# EAGLE design HM_Core (EAGLE 9.2.2)
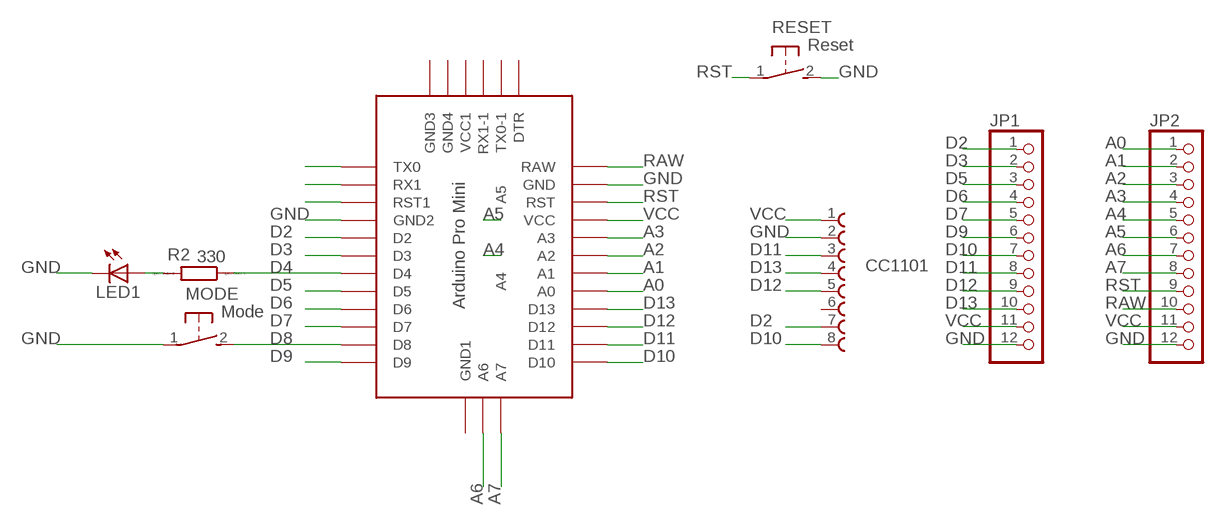
[diagram p0: schematic, sheet 1]

## Parts
CC1101  62000811121  [62000811121]
JP1  PINHD-1X12  [1X12]
JP2  PINHD-1X12  [1X12]
LED1  LED3MM  [LED3MM]
MODE  Mode  31-XX  [B3F-31XX]
R2  330  R0207/10  [0207/10]
RESET  Reset  31-XX  [B3F-31XX]
U$1  ABK-PRO-MINI  [ABK-PRO-MINI]

## Nets
A0: JP2.1 U$1.A0
A1: JP2.2 U$1.A1
A2: JP2.3 U$1.A2
A3: JP2.4 U$1.A3
A4: JP2.5 U$1.A4
A5: JP2.6 U$1.A5
A6: JP2.7 U$1.A6
A7: JP2.8 U$1.A7
D2: CC1101.7 JP1.1 U$1.D2
D3: JP1.2 U$1.D3
D4: R2.1 U$1.D4
D5: JP1.3 U$1.D5
D6: JP1.4 U$1.D6
D7: JP1.5 U$1.D7
D8: MODE.2(S) U$1.D8
D9: JP1.6 U$1.D9
D10: CC1101.8 JP1.7 U$1.D10
D11: CC1101.3 JP1.8 U$1.D11
D12: CC1101.5 JP1.9 U$1.D12
D13: CC1101.4 JP1.10 U$1.D13
GND: CC1101.2 JP1.12 JP2.12 LED1.K(C) MODE.1(P) RESET.2(S) U$1.GND U$1.GND1(GND2)
N$2: LED1.A R2.2
N$42: U$1.TX0
N$43: U$1.RX1
N$44: U$1.RST1
RAW: JP2.10 U$1.RAW
RST: JP2.9 RESET.1(P) U$1.RST
VCC: CC1101.1 JP1.11 JP2.11 U$1.VCC
Unconnected: CC1101.6 U$1.DTR U$1.GND2(GND3) U$1.GND3(GND4) U$1.GND4(GND1) U$1.RX1-1 U$1.TX0-1 U$1.VCC1

## Library data of the parts
CC1101 = Wurth_Elektronik_Electromechanic_Board_to_Board_Connectors_rev18b:62000811121: WR-PHD 2.00mm Pin Header, 8 Pins=>Code : Con_BTB_PHD_2.00_1_THT_62000811121 <http://katalog.we-online.de/media/images/eican/Con_BTB_PHD_2.00_1_THT_6200xx11121_pf2.jpg> Details see: http://katalog.we-online.de/en/em/620_0xx_111_21 Created 2014-06-03, Karrer Zheng 2014 (C) Würth Elektronik
JP1 JP2 = adafruit:PINHD-1X12: PIN HEADER
LED1 = led:LED: LED OSRAM: - CHIPLED LG R971, LG N971, LY N971, LG Q971, LY Q971, LO R971, LY R971 LH N974, LH R974 LS Q976, LO Q976, LY Q976 LO Q996 - Hyper CHIPLED LW Q18S LB Q993, LB Q99A, LB R99A - SideLED LS A670, LO A670, LY A670, LG A670, LP A670 LB A673, LV A673, LT A673, LW A673 LH A674 LY A675 LS A676, LA A676, LO A676, LY A676, LW A676 LS A679, LY A679, LG A679 - Hyper Micro SIDELED® LS Y876, LA Y876, LO Y876, LY Y876 LT Y87S - SmartLED LW L88C, LW L88S LB L89C, LB L89S, LG L890 LS L89K, LO L89K, LY L89K LS L896, LA L896, LO L896, LY L896 - TOPLED LS T670, LO T670, LY T670, LG T670, LP T670 LSG T670, LSP T670, LSY T670, LOP T670, LYG T670 LG T671, LOG T671, LSG T671 LB T673, LV T673, LT T673, LW T673 LH T674 LS T676, LA T676, LO T676, LY T676, LB T676, LH T676, LSB T676, LW T676 LB T67C, LV T67C, LT T67C, LS T67K, LO T67K, LY T67K, LW E67C LS E67B, LA E67B, LO E67B, LY E67B, LB E67C, LV E67C, LT E67C LW T67C LS T679, LY T679, LG T679 LS T770, LO T770, LY T770, LG T770, LP T770 LB T773, LV T773, LT T773, LW T773 LH T774 LS E675, LA E675, LY E675, LS T675 LS T776, LA T776, LO T776, LY T776, LB T776 LHGB T686 LT T68C, LB T68C - Hyper Mini TOPLED® LB M676 - Mini TOPLED Santana® LG M470 LS M47K, LO M47K, LY M47K Source: http://www.osram.convergy.de LUXEON: - LUMILED® LXK2-PW12-R00, LXK2-PW12-S00, LXK2-PW14-U00, LXK2-PW14-V00 LXK2-PM12-R00, LXK2-PM12-S00, LXK2-PM14-U00 LXK2-PE12-Q00, LXK2-PE12-R00, LXK2-PE12-S00, LXK2-PE14-T00, LXK2-PE14-U00 LXK2-PB12-K00, LXK2-PB12-L00, LXK2-PB12-M00, LXK2-PB14-N00, LXK2-PB14-P00, LXK2-PB14-Q00 LXK2-PR12-L00, LXK2-PR12-M00, LXK2-PR14-Q00, LXK2-PR14-R00 LXK2-PD12-Q00, LXK2-PD12-R00, LXK2-PD12-S00 LXK2-PH12-R00, LXK2-PH12-S00 LXK2-PL12-P00, LXK2-PL12-Q00, LXK2-PL12-R00 Source: www.luxeon.com KINGBRIGHT: KA-3528ASYC Source: www.kingbright.com
MODE RESET = switch-omron:31-XX: OMRON SWITCH; MPN: B3F-3100; OC_FARNELL: 959704; OC_NEWARK: 36M3582
R2 = eagle-ltspice:R: RESISTOR, European symbol; SPICEMODEL: NONE; SPICEPREFIX: R
U$1 = Arduino-clone:ABK-PRO-MINI: ABK Pro-Mini Arduino Clone

## Board
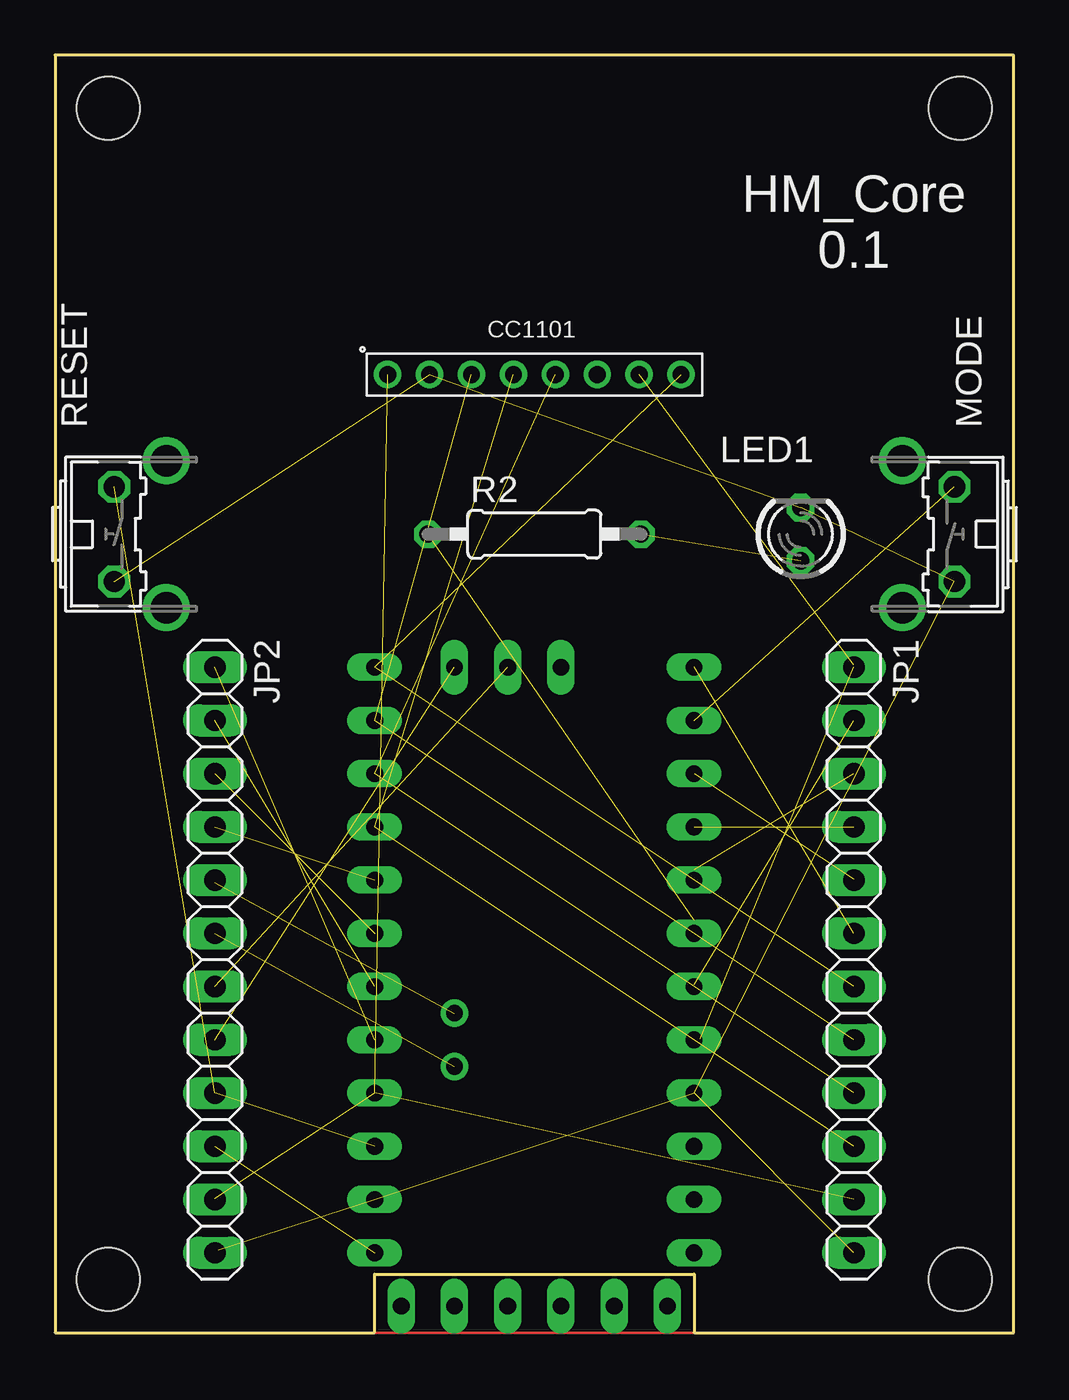
[diagram p1: board, top side]
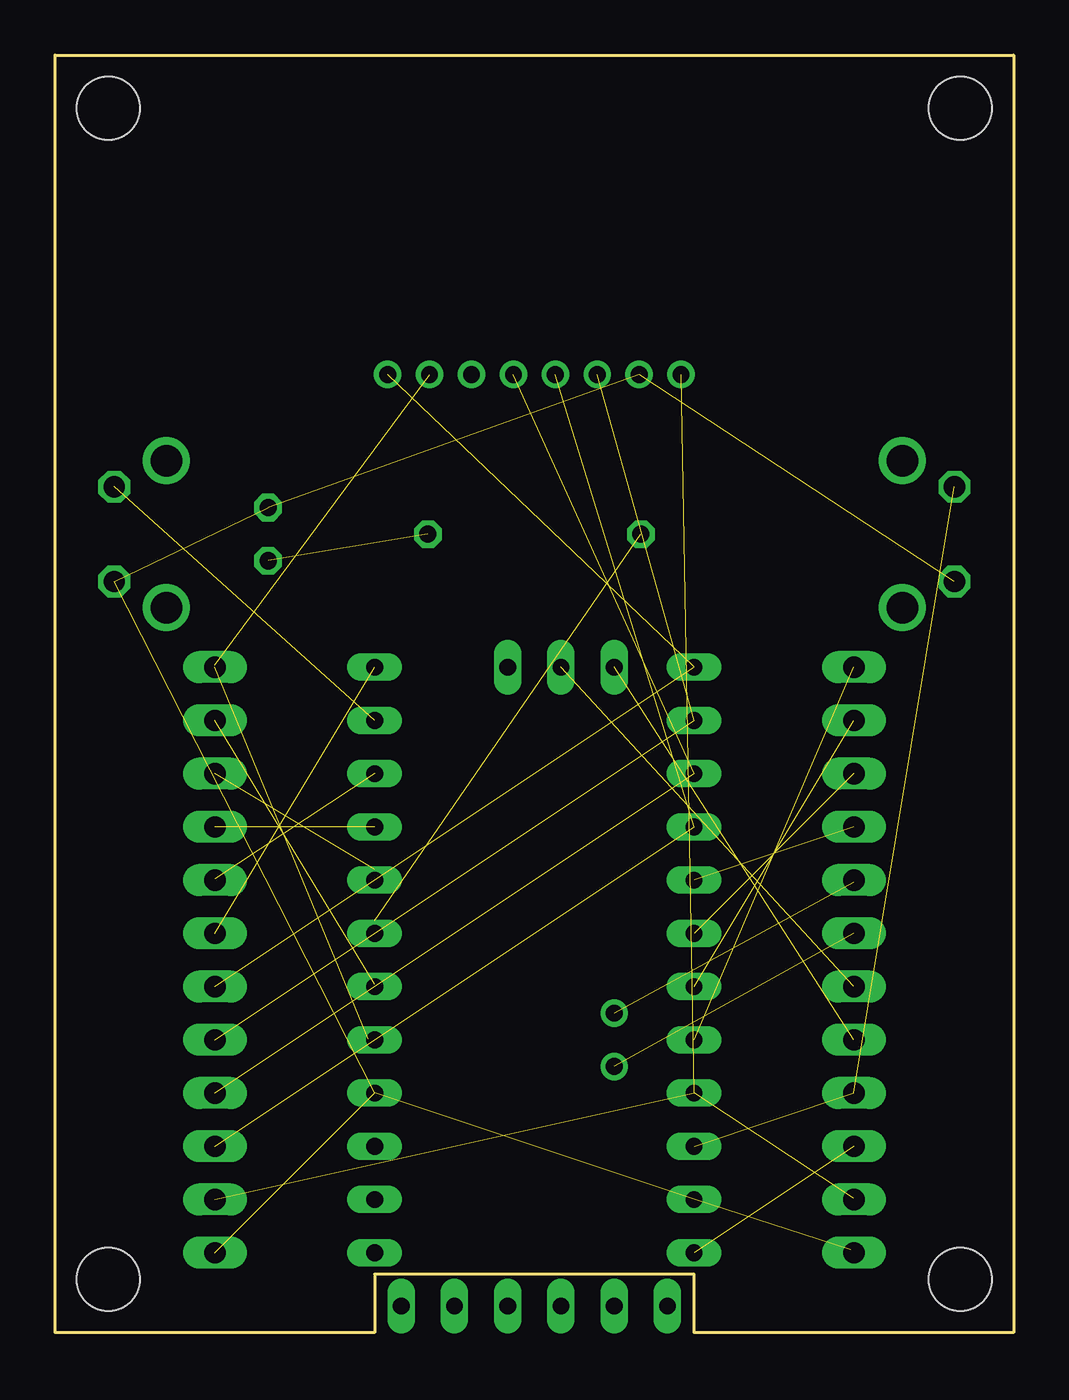
[diagram p2: board, bottom side, seen from below]

Size 45.72 x 60.96 mm. Coordinates in mm from the lower left corner, seen from the top.
Outline: 12.7,0 15.24,0
Outline: 15.24,0 0,0 0,60.96 45.72,60.96 45.72,0 30.48,0 30.48,2.79 15.24,2.79 15.24,0
Copper layers (1*16): Top 0.035mm / dielectric 1.5mm / Bottom 0.035mm
Design rules "default": minimum track width 6mil, minimum drill 0.35mm, track to track 6mil, track to pad 6mil, pad to pad 6mil, via to via 6mil, smd to smd 6mil, copper to edge 40mil, drill to drill 6mil, minimum pad ring 10mil, minimum via ring 8mil, stop-mask expansion 4mil, vias tented up to drill 0mil, thermal gap 10mil
Holes 3 mm at 2.54,2.54 2.54,58.42 43.18,2.54 43.18,58.42

### Footprints (pad centres in the part's own frame; a part is rotated, then mirrored left to right if it is on the bottom)
62000811121 = drill 0.8: 1 -7,0; 2 -5,0; 3 -3,0; 4 -1,0; 5 1,0; 6 3,0; 7 5,0; 8 7,0
1X12 = drill 1.016 long: 1 -13.97,0; 2 -11.43,0; 3 -8.89,0; 4 -6.35,0; 5 -3.81,0; 6 -1.27,0; 7 1.27,0; 8 3.81,0; 9 6.35,0; 10 8.89,0; 11 11.43,0; 12 13.97,0
LED3MM = drill 0.813 octagon: A -1.27,0; K 1.27,0
B3F-31XX = drill 1.016 octagon: 1 -2.261,-1.245; 2 2.261,-1.245 | drill 1.499 pad 2.159: 3 -3.505,1.245; 4 3.505,1.245
0207/10 = drill 0.813 octagon: 1 -5.08,0; 2 5.08,0
ABK-PRO-MINI = drill 0.8 long: A0 10.16,-3.81; A1 10.16,-6.35; A2 10.16,-8.89; A3 10.16,-11.43; A6 3.81,-21.59; A7 6.35,-21.59; D2 -5.08,-3.81; D3 -5.08,-6.35; D4 -5.08,-8.89; D5 -5.08,-11.43; D6 -5.08,-13.97; D7 -5.08,-16.51; D8 -5.08,-19.05; D9 -5.08,-21.59; D10 10.16,-21.59; D11 10.16,-19.05; D12 10.16,-16.51; D13 10.16,-13.97; DTR 8.89,8.89; GND 10.16,3.81; GND1 -5.08,-1.27; GND2 -3.81,8.89; GND3 -1.27,8.89; GND4 1.27,-21.59; RAW 10.16,6.35; RST 10.16,1.27; RST1 -5.08,1.27; RX1 -5.08,3.81; RX1-1 3.81,8.89; TX0 -5.08,6.35; TX0-1 6.35,8.89; VCC 10.16,-1.27; VCC1 1.27,8.89 | drill 0.8: A4 6.35,-5.08; A5 6.35,-2.54

### Placement (x,y rotation side)
CC1101  22.86,45.72 0 top
JP1  38.1,17.78 270 top
JP2  7.62,17.78 270 top
LED1  35.56,38.1 90 top
MODE  41.66,38.1 90 top
R2  22.86,38.1 0 top
RESET  4.06,38.1 270 top
U$1  25.4,10.16 180 top

### Tracks (layer width: path | path; a pad name or v marks a point on that pad's centre or on a via)
A0  (1 unrouted)
A1  (1 unrouted)
A2  (1 unrouted)
A3  (1 unrouted)
A4  (1 unrouted)
  Bottom 0.152: 7.62,21.49 JP2.5
A5  (1 unrouted)
A6  (1 unrouted)
A7  (1 unrouted)
D2  (2 unrouted)
  Bottom 0.152: 38.1,31.85 JP1.1 | 30.79,14.02 30.48,14.02 U$1.D2
D3  (1 unrouted)
  Bottom 0.152: 30.48,16.61 U$1.D3
D4  (1 unrouted)
  Bottom 0.152: 30.48,19.66 U$1.D4
D5  (1 unrouted)
  Bottom 0.152: 30.48,22.1 U$1.D5
D6  (1 unrouted)
  Top 0.152: 30.48,24.23 U$1.D6 | 38.1,24.23 JP1.4
D7  (1 unrouted)
  Bottom 0.152: 38.1,21.64 JP1.5
D8  (1 unrouted)
D9  (1 unrouted)
D10  (2 unrouted)
D11  (2 unrouted)
D12  (2 unrouted)
D13  (2 unrouted)
GND  (7 unrouted)
  Bottom 0.152: 7.77,3.96 JP2.12
N$2  (1 unrouted)
RAW  (1 unrouted)
RST  (2 unrouted)
VCC  (3 unrouted)
  Bottom 0.152: 7.62,6.4 JP2.11
(copper drawn outside any net)
  shapes: Top area x2

### Text on the board
tNames: HM_Core / 0.1